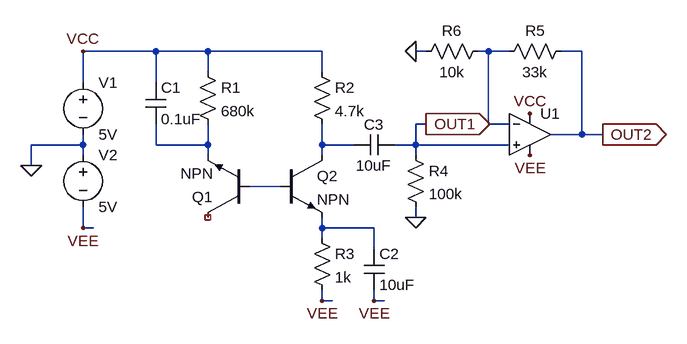
[diagram p0: schematic Noise Generator+AMP.asc]
Noise Generator+AMP.asc, the LTspice schematic file:
Version 4
SHEET 1 900 680
WIRE 80 -32 -32 -32
WIRE 160 -32 80 -32
WIRE 336 -32 160 -32
WIRE 496 -32 480 -32
WIRE 592 -32 576 -32
WIRE 624 -32 592 -32
WIRE 736 -32 704 -32
WIRE 160 0 160 -32
WIRE 336 0 336 -32
WIRE -32 16 -32 -32
WIRE 80 16 80 -32
WIRE 496 80 480 80
WIRE 592 80 592 -32
WIRE 624 80 592 80
WIRE 736 96 736 -32
WIRE 736 96 688 96
WIRE 768 96 736 96
WIRE -32 112 -32 96
WIRE -32 112 -112 112
WIRE 80 112 80 80
WIRE 160 112 160 80
WIRE 160 112 80 112
WIRE 336 112 336 80
WIRE 384 112 336 112
WIRE 480 112 480 80
WIRE 480 112 448 112
WIRE 624 112 480 112
WIRE -32 128 -32 112
WIRE 160 128 160 112
WIRE 336 128 336 112
WIRE 480 128 480 112
WIRE -112 144 -112 112
WIRE 272 176 224 176
WIRE 480 224 480 208
WIRE -32 240 -32 208
WIRE -16 240 -32 240
WIRE 336 240 336 224
WIRE 416 240 336 240
WIRE 336 256 336 240
WIRE 416 272 416 240
WIRE 336 352 336 336
WIRE 352 352 336 352
WIRE 416 352 416 336
WIRE 432 352 416 352
FLAG 768 96 OUT2
IOPIN 768 96 Out
FLAG -112 144 0
FLAG 480 224 0
FLAG -32 240 VEE
FLAG -32 -32 VCC
FLAG 656 64 VCC
FLAG 656 128 VEE
FLAG 480 -32 0
FLAG 336 352 VEE
FLAG 416 352 VEE
FLAG 496 80 OUT1
IOPIN 496 80 Out
SYMBOL npn 224 224 R180
SYMATTR InstName Q1
SYMBOL res 144 -16 R0
SYMATTR InstName R1
SYMATTR Value 680k
SYMBOL cap 64 16 R0
SYMATTR InstName C1
SYMATTR Value 0.1uF
SYMBOL npn 272 128 R0
SYMATTR InstName Q2
SYMBOL res 320 -16 R0
SYMATTR InstName R2
SYMATTR Value 4.7k
SYMBOL res 320 240 R0
SYMATTR InstName R3
SYMATTR Value 1k
SYMBOL cap 400 272 R0
SYMATTR InstName C2
SYMATTR Value 10uF
SYMBOL voltage -32 0 R0
WINDOW 123 0 0 Left 2
WINDOW 39 0 0 Left 2
SYMATTR InstName V1
SYMATTR Value 5V
SYMBOL cap 448 96 R90
WINDOW 0 0 32 VBottom 2
WINDOW 3 32 32 VTop 2
SYMATTR InstName C3
SYMATTR Value 10uF
SYMBOL res 464 112 R0
SYMATTR InstName R4
SYMATTR Value 100k
SYMBOL voltage -32 112 R0
WINDOW 123 0 0 Left 2
WINDOW 39 0 0 Left 2
SYMATTR InstName V2
SYMATTR Value 5V
SYMBOL Opamps\\UniversalOpamp2 656 96 R0
SYMATTR InstName U1
SYMBOL res 720 -48 R90
WINDOW 0 0 56 VBottom 2
WINDOW 3 32 56 VTop 2
SYMATTR InstName R5
SYMATTR Value 33k
SYMBOL res 592 -48 R90
WINDOW 0 0 56 VBottom 2
WINDOW 3 32 56 VTop 2
SYMATTR InstName R6
SYMATTR Value 10k

The netlist it stands for:
* Noise Generator+AMP.asc
Q1 NC_01 N004 N002 0 NPN
R1 VCC N002 680k
C1 VCC N002 0.1uF
Q2 N003 N004 N005 0 NPN
R2 VCC N003 4.7k
R3 N005 VEE 1k
C2 N005 VEE 10uF
V1 VCC 0 5V
C3 OUT1 N003 10uF
R4 OUT1 0 100k
V2 0 VEE 5V
XU1 OUT1 N001 VCC VEE OUT2 level.2 Avol=1Meg GBW=10Meg Slew=10Meg ilimit=25m rail=0 Vos=0 phimargin=45 en=0 enk=0 in=0 ink=0 Rin=500Meg  ; pins IN+ IN- V+ V- OUT
R5 OUT2 N001 33k
R6 N001 0 10k
.model NPN NPN
.model PNP PNP
.lib standard.bjt
.lib UniversalOpamps2.sub
.backanno
.end